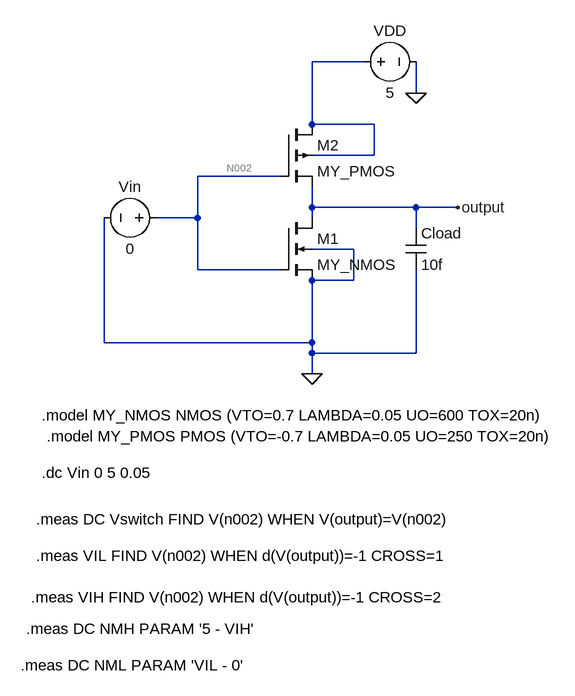
[diagram p0: schematic Inverter_VTC_asymmetrical.asc]
Inverter_VTC_asymmetrical.asc, the LTspice schematic file:
Version 4.1
SHEET 1 880 704
WIRE 272 -240 192 -240
WIRE 352 -192 352 -240
WIRE 192 -144 192 -240
WIRE 288 -144 192 -144
WIRE 288 -96 288 -144
WIRE 288 -96 192 -96
WIRE 144 -64 16 -64
WIRE 192 -16 192 -48
WIRE 352 -16 192 -16
WIRE 416 -16 352 -16
WIRE 16 0 16 -64
WIRE 16 0 -48 0
WIRE 192 0 192 -16
WIRE 352 16 352 -16
WIRE 256 48 192 48
WIRE 16 80 16 0
WIRE 144 80 16 80
WIRE 256 96 256 48
WIRE 256 96 192 96
WIRE -128 192 -128 0
WIRE 192 192 192 96
WIRE 192 192 -128 192
WIRE 192 208 192 192
WIRE 352 208 352 80
WIRE 352 208 192 208
WIRE 192 240 192 208
FLAG 192 240 0
FLAG 352 -192 0
FLAG 416 -16 output
SYMBOL nmos4 144 0 R0
SYMATTR InstName M1
SYMATTR Value MY_NMOS
SYMATTR Value2 l=1u w=1u
SYMBOL voltage -32 0 R90
WINDOW 0 -32 56 VBottom 2
WINDOW 3 32 56 VTop 2
WINDOW 123 0 0 Left 0
WINDOW 39 0 0 Left 0
SYMATTR InstName Vin
SYMATTR Value 0
SYMBOL voltage 256 -240 R270
WINDOW 0 32 56 VTop 2
WINDOW 3 -32 56 VBottom 2
WINDOW 123 0 0 Left 0
WINDOW 39 0 0 Left 0
SYMATTR InstName VDD
SYMATTR Value 5
SYMBOL cap 336 16 R0
SYMATTR InstName Cload
SYMATTR Value 10f
SYMBOL pmos4 144 -144 R0
SYMATTR InstName M2
SYMATTR Value MY_PMOS
SYMATTR Value2 l=1u w=1u
TEXT -224 304 Left 2 !.model MY_NMOS NMOS (VTO=0.7 LAMBDA=0.05 UO=600 TOX=20n)
TEXT -216 336 Left 2 !.model MY_PMOS PMOS (VTO=-0.7 LAMBDA=0.05 UO=250 TOX=20n)
TEXT -224 392 Left 2 !.dc Vin 0 5 0.05
TEXT -232 464 Left 2 !.meas DC Vswitch FIND V(n002) WHEN V(output)=V(n002)
TEXT -232 520 Left 2 !.meas VIL FIND V(n002) WHEN d(V(output))=-1 CROSS=1
TEXT -240 584 Left 2 !.meas VIH FIND V(n002) WHEN d(V(output))=-1 CROSS=2
TEXT -248 632 Left 2 !.meas DC NMH PARAM '5 - VIH'
TEXT -256 688 Left 2 !.meas DC NML PARAM 'VIL - 0'

The netlist it stands for:
* Inverter_VTC_asymmetrical.asc
M1 output N002 0 0 MY_NMOS l=1u w=1u
Vin N002 0 0
VDD N001 0 5
Cload output 0 10f
M2 N001 N002 output N001 MY_PMOS l=1u w=1u
.model NMOS NMOS
.model PMOS PMOS
.lib standard.mos
.model MY_NMOS NMOS (VTO=0.7 LAMBDA=0.05 UO=600 TOX=20n)
.model MY_PMOS PMOS (VTO=-0.7 LAMBDA=0.05 UO=250 TOX=20n)
.dc Vin 0 5 0.05
.meas DC Vswitch FIND V(n002) WHEN V(output)=V(n002)
.meas VIL FIND V(n002) WHEN d(V(output))=-1 CROSS=1
.meas VIH FIND V(n002) WHEN d(V(output))=-1 CROSS=2
.meas DC NMH PARAM '5 - VIH'
.meas DC NML PARAM 'VIL - 0'
.backanno
.end